# Altium schematic sheet #NIP涡轮驱动板-3.SchDoc
size A3
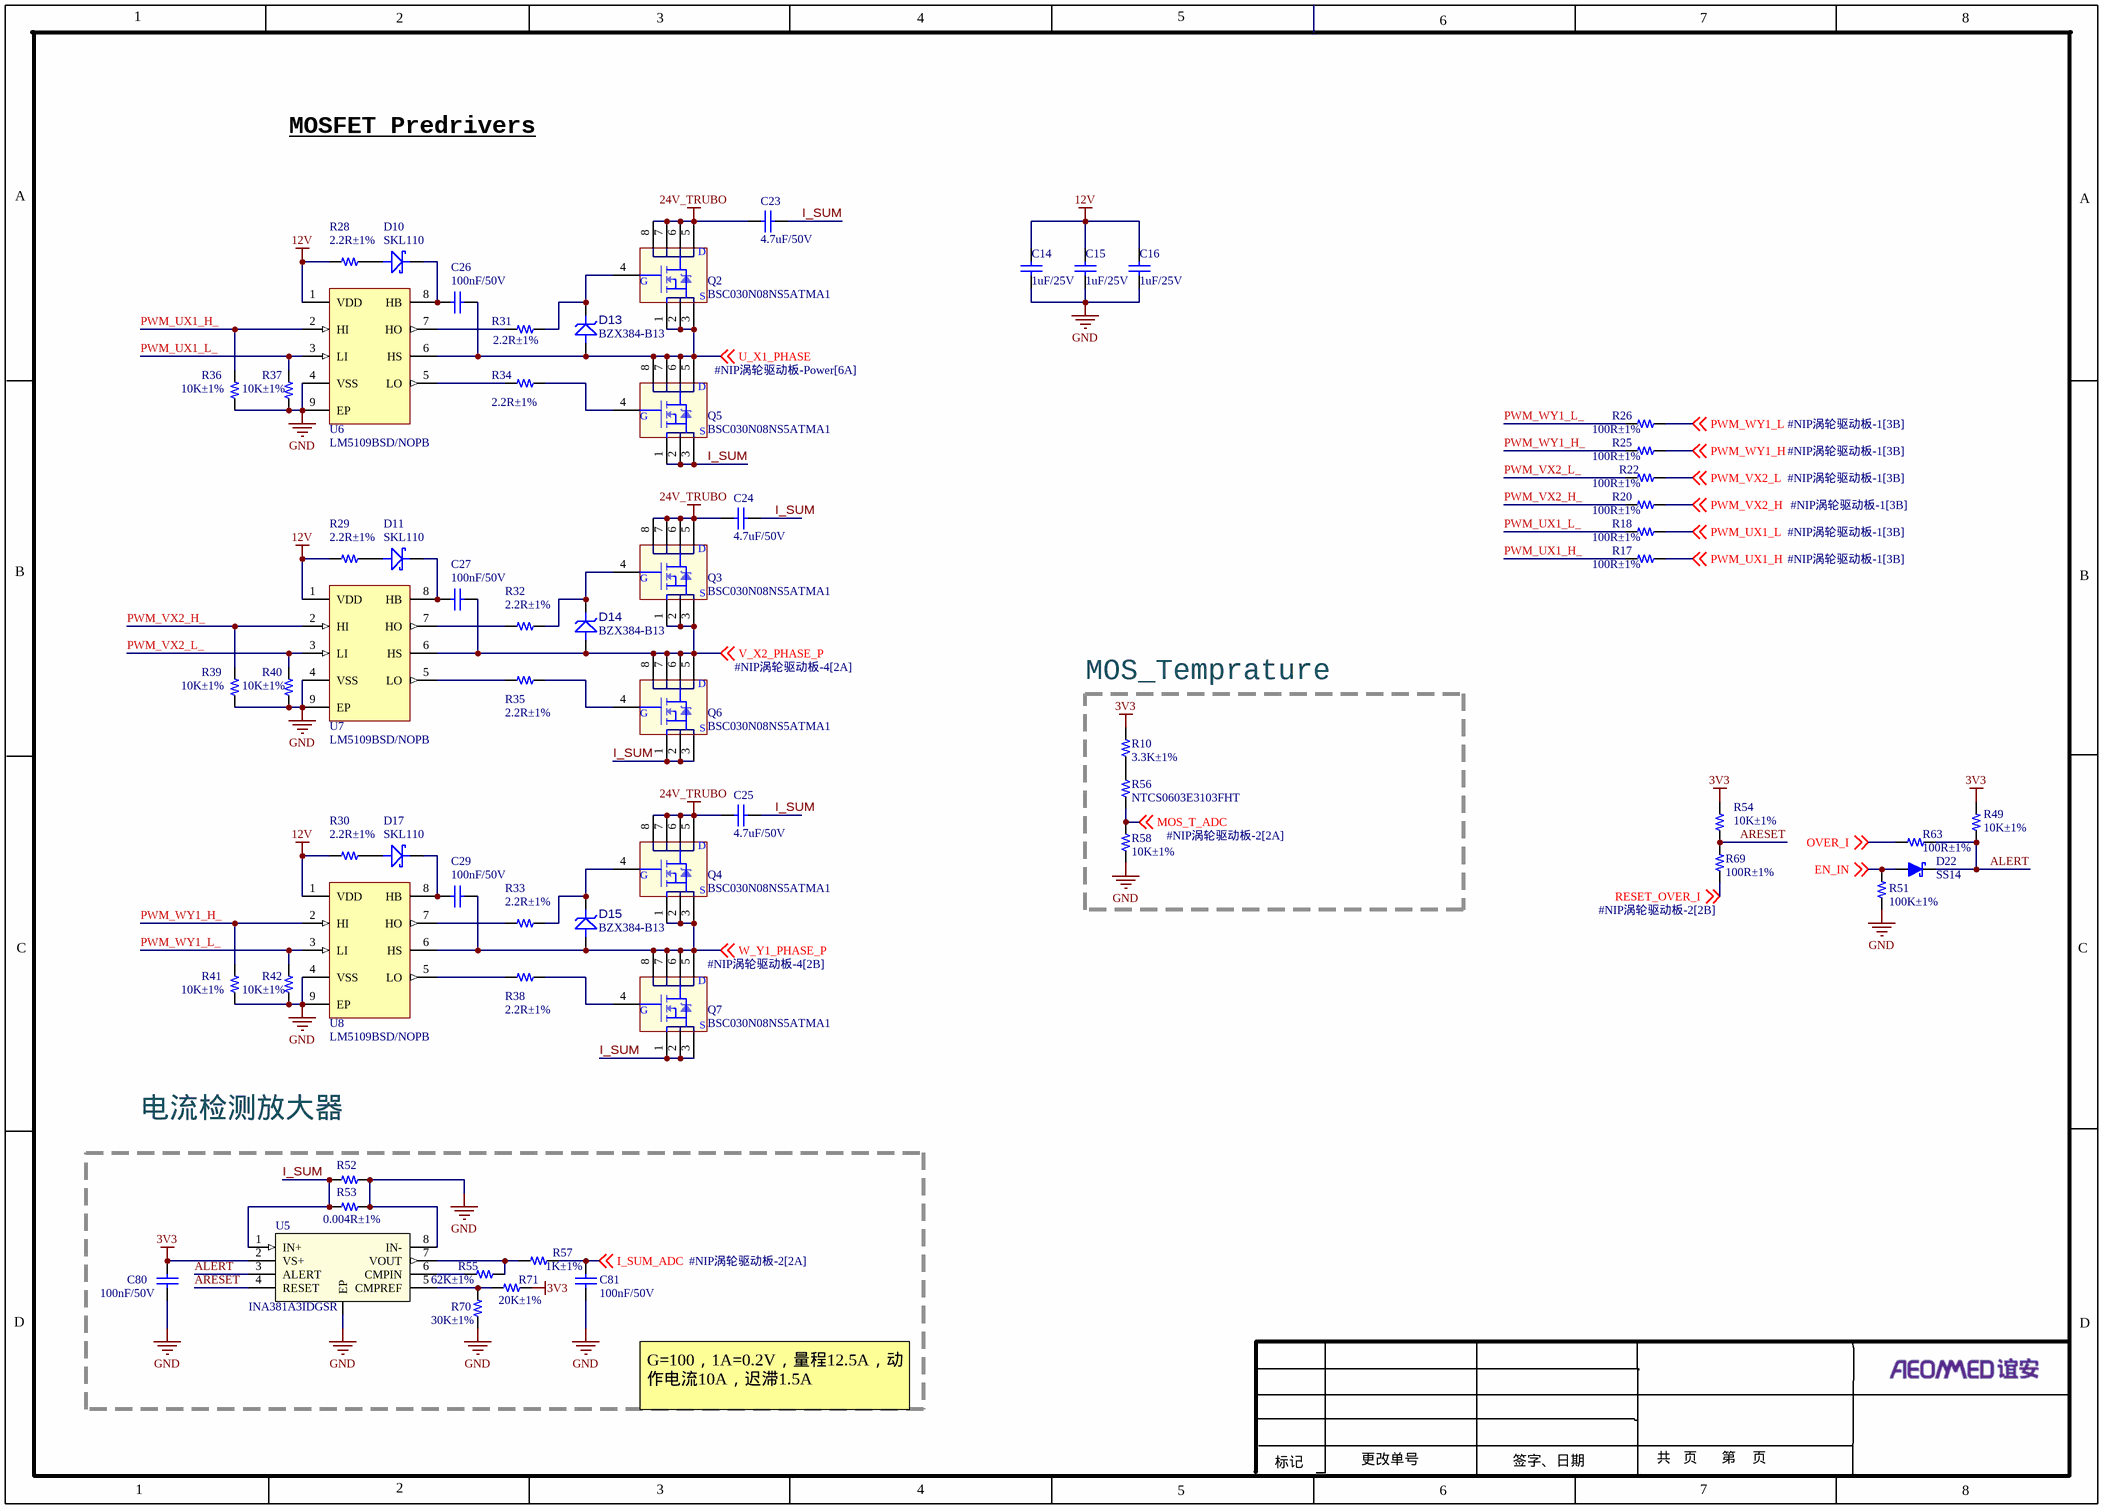
[diagram p0: #NIP涡轮驱动板-3.SchDoc]

## Parts
C14  1uF/25V  [C-0805]
C15  1uF/25V  [C-0805]
C16  1uF/25V  [C-0805]
C23  4.7uF/50V  [C-1210]
C24  4.7uF/50V  [C-1210]
C25  4.7uF/50V  [C-1210]
C26  100nF/50V  [C-0603]
C27  100nF/50V  [C-0603]
C29  100nF/50V  [C-0603]
C80  100nF/50V  [C0402]
C81  100nF/50V  [C0402]
D10  SKL110  [SODFL370X140-2N]
D11  SKL110  [SODFL370X140-2N]
D13  BZX384-B13  [SOD2512X100N]
D14  BZX384-B13  [SOD2512X100N]
D15  BZX384-B13  [SOD2512X100N]
D17  SKL110  [SODFL370X140-2N]
D22  SS14  [DO-214AC/SMA]
Q2  BSC030N08NS5ATMA1  [PG-TDSON-8]
Q3  BSC030N08NS5ATMA1  [PG-TDSON-8]
Q4  BSC030N08NS5ATMA1  [PG-TDSON-8]
Q5  BSC030N08NS5ATMA1  [PG-TDSON-8]
Q6  BSC030N08NS5ATMA1  [PG-TDSON-8]
Q7  BSC030N08NS5ATMA1  [PG-TDSON-8]
R10  3.3K±1%  [R0402]
R17  100R±1%  [R0402]
R18  100R±1%  [R0402]
R20  100R±1%  [R0402]
R22  100R±1%  [R0402]
R25  100R±1%  [R0402]
R26  100R±1%  [R0402]
R28  2.2R±1%  [R-0603]
R29  2.2R±1%  [R-0603]
R30  2.2R±1%  [R-0603]
R31  2.2R±1%  [R-0603]
R32  2.2R±1%  [R-0603]
R33  2.2R±1%  [R-0603]
R34  2.2R±1%  [R-0603]
R35  2.2R±1%  [R-0603]
R36  10K±1%  [R0402]
R37  10K±1%  [R0402]
R38  2.2R±1%  [R-0603]
R39  10K±1%  [R0402]
R40  10K±1%  [R0402]
R41  10K±1%  [R0402]
R42  10K±1%  [R0402]
R49  10K±1%  [R0402]
R51  100K±1%  [R0402]
R52  0.004R±1%  [R-2512_4PIN]  (value not drawn)
R53  0.004R±1%  [R-2512_4PIN]
R54  10K±1%  [R0402]
R55  62K±1%  [R0402]
R56  NTCS0603E3103FHT  [R-0603]
R57  1K±1%  [R0402]
R58  10K±1%  [R0402]
R63  100R±1%  [R0402]
R69  100R±1%  [R0402]
R70  30K±1%  [R0402]
R71  20K±1%  [R0402]
U5  INA381A3IDGSR  [WSON-8_L2.0-W2.0-P0.50-BL-EP0.9]
U6  LM5109BSD/NOPB  [PSON80P400X80_HS-9N]
U7  LM5109BSD/NOPB  [PSON80P400X80_HS-9N]
U8  LM5109BSD/NOPB  [PSON80P400X80_HS-9N]

## Blocks framed on the sheet
MOS_Temprature: R10 R56 R58

## Nets
3V3: C80.2 R10.2 R49.1 R54.1 R71.2 U5.2(VS+)
12V: C14.2 C15.2 C16.2 R28.2 R29.2 R30.2 U6.1(VDD) U7.1(VDD) U8.1(VDD)
24V_TRUBO: C23.2 C24.2 C25.2 Q2.5(D) Q2.6(D) Q2.7(D) Q2.8(D) Q3.5(D) Q3.6(D) Q3.7(D) Q3.8(D) Q4.5(D) Q4.6(D) Q4.7(D) Q4.8(D)
GND: C14.1 C15.1 C16.1 C80.1 C81.1 R36.1 R37.1 R39.1 R40.1 R41.1 R42.1 R51.2 R52.1 R53.1 R58.1 R70.1 U5.8(IN-) U5.9(EP) U6.4(VSS) U6.9(EP) U7.4(VSS) U7.9(EP) U8.4(VSS) U8.9(EP)
ALERT: D22.K R49.2 R63.1 U5.3(ALERT)
ARESET: R54.2 R69.1 U5.4(RESET)
EN_IN: D22.A R51.1 ; off-sheet EN_IN
I_SUM: C23.1 C24.1 C25.1 Q5.1(S) Q5.2(S) Q5.3(S) Q6.1(S) Q6.2(S) Q6.3(S) Q7.1(S) Q7.2(S) Q7.3(S) R52.2 R53.2 U5.1(IN+)
I_SUM_ADC: C81.2 R57.2 ; off-sheet I_SUM_ADC
MOS_T_ADC: R56.1 R58.2 ; off-sheet MOS_T_ADC
OVER_I: R63.2 ; off-sheet OVER_I
PWM_UX1_H: R17.2 ; off-sheet PWM_UX1_H
PWM_UX1_H_: R17.1 R36.2 U6.2(HI)
PWM_UX1_L: R18.2 ; off-sheet PWM_UX1_L
PWM_UX1_L_: R18.1 R37.2 U6.3(LI)
PWM_VX2_H: R20.2 ; off-sheet PWM_VX2_H
PWM_VX2_H_: R20.1 R39.2 U7.2(HI)
PWM_VX2_L: R22.2 ; off-sheet PWM_VX2_L
PWM_VX2_L_: R22.1 R40.2 U7.3(LI)
PWM_WY1_H: R25.2 ; off-sheet PWM_WY1_H
PWM_WY1_H_: R25.1 R41.2 U8.2(HI)
PWM_WY1_L: R26.2 ; off-sheet PWM_WY1_L
PWM_WY1_L_: R26.1 R42.2 U8.3(LI)
RESET_OVER_I: R69.2 ; off-sheet RESET_OVER_I
U_X1_PHASE: C26.1 D13.2(A) Q2.1(S) Q2.2(S) Q2.3(S) Q5.5(D) Q5.6(D) Q5.7(D) Q5.8(D) U6.6(HS) ; off-sheet U_X1_PHASE
V_X2_PHASE_P: C27.1 D14.2(A) Q3.1(S) Q3.2(S) Q3.3(S) Q6.5(D) Q6.6(D) Q6.7(D) Q6.8(D) U7.6(HS) ; off-sheet V_X2_PHASE_P
W_Y1_PHASE_P: C29.1 D15.2(A) Q4.1(S) Q4.2(S) Q4.3(S) Q7.5(D) Q7.6(D) Q7.7(D) Q7.8(D) U8.6(HS) ; off-sheet W_Y1_PHASE_P
NetC26_2: C26.2 D10.1 U6.8(HB)
NetC27_2: C27.2 D11.1 U7.8(HB)
NetC29_2: C29.2 D17.1 U8.8(HB)
NetD10_2: D10.2 R28.1
NetD11_2: D11.2 R29.1
NetD13_1: D13.1(K) Q2.4(G) R31.1
NetD14_1: D14.1(K) Q3.4(G) R32.1
NetD15_1: D15.1(K) Q4.4(G) R33.1
NetD17_2: D17.2 R30.1
NetQ5_4: Q5.4(G) R34.1
NetQ6_4: Q6.4(G) R35.1
NetQ7_4: Q7.4(G) R38.1
NetR10_1: R10.1 R56.2
NetR31_2: R31.2 U6.7(HO)
NetR32_2: R32.2 U7.7(HO)
NetR33_2: R33.2 U8.7(HO)
NetR34_2: R34.2 U6.5(LO)
NetR35_2: R35.2 U7.5(LO)
NetR38_2: R38.2 U8.5(LO)
NetR55_1: R55.1 U5.6(CMPIN)
NetR55_2: R55.2 R57.1 U5.7(VOUT)
NetR70_2: R70.2 R71.1 U5.5(CMPREF)

## Notes on the sheet
- MOSFET Predrivers
- 电流检测放大器
- G=100，1A=0.2V，量程12.5A，动作电流10A，迟滞1.5A
- 1
- 2
- 3
- 4
- 5
- 6
- 7
- 8
- A
- B
- C
- D
- 更改单号
- 共   页      第    页
- 标记
- 签字、日期

## Library data of the parts
C14-C16 = C-0805
C23-C25 = C-1210
C26 C27 C29 C80 C81 = C-0603: 物料编号: *; 物料名称: *; 厂家: *; 详细描述: *
D10 D11 D17 = 50491: 品牌：DIOTEC，型号：SKL110，1A，100V，ROHS; Manufacturer: Diotec  Semiconductor; Id: 50491; Type: Diode; Value: 1A, 100V; Part Number: SKL110; HelpURL: http://diotec.com/tl_files/diotec/files/pdf/datasheets/skl12
D13-D15 = ZENER: 品牌：NXP，型号：BZX384-B13，13V，SOD-323，ROHS; Manufacturer: Nexperia; Id: 50513; Type: ZEN; Value: 13V, 0.3W; Part Number: BZX384-B13; HelpURL: http://assets.nexperia.com/documents/data-sheet/BZX384_SERIES.pdf
D22 = Diode- 肖特基-214AC  (SMA): 品牌：VISHAY,型号：SS14,1A,40V,ROHS; 版本: V1.00; 物料编号: APLLY; 制造商: VISHAY; 名称: SS14; 详细描述: 品牌：VISHAY,型号：SS14,1A,40V,ROHS
Q2-Q7 = BSC027N04LS: 品牌：INFINEON，型号： BSC027N04LSG，40V，100A，ROHS; 版本: V1.00; 物料编号: apply; 名称: BSC030N08NS5ATMA1; 详细描述: 品牌：INFINEON，型号： BSC027N04LSG，40V，100A，ROHS; 制造商: Infineon
R10 R17 R18 R20 R22 R25 R26 R28-R42 R49 R51 R54 R55 R57 R58 R63 R69-R71 = R-0603
R52 R53 = R-2512
R56 = R-0603: 品牌：VISHAY，型号：NTCS0603E3103FHT，10K@25℃, 1%，B=3960,ROHS
U5 = INA381A2IDSGR: 品牌：TI，型号：INA381A1IDGSR，ROHS; Mfr_Name: Texas Instruments; Copyright: Copyright (C) 2022 Ultra Librarian. All rights reserved.; Manufacturer_Part_Number: INA381A3IDGSR; RefDes: RefDes; Type: DEV
U6-U8 = LM5109: 品牌：TI，型号：LM5109BSD/NOPB，ROHS; Manufacturer: Texas Instruments; Id: 50490; Value: 108V 1A; Part Number: LM5109BSD/NOPB; Type: DRV; HelpURL: http://www.ti.com/lit/ds/symlink/lm5109b.pdf